# Altium project PCB_Project_2.PrjPcb
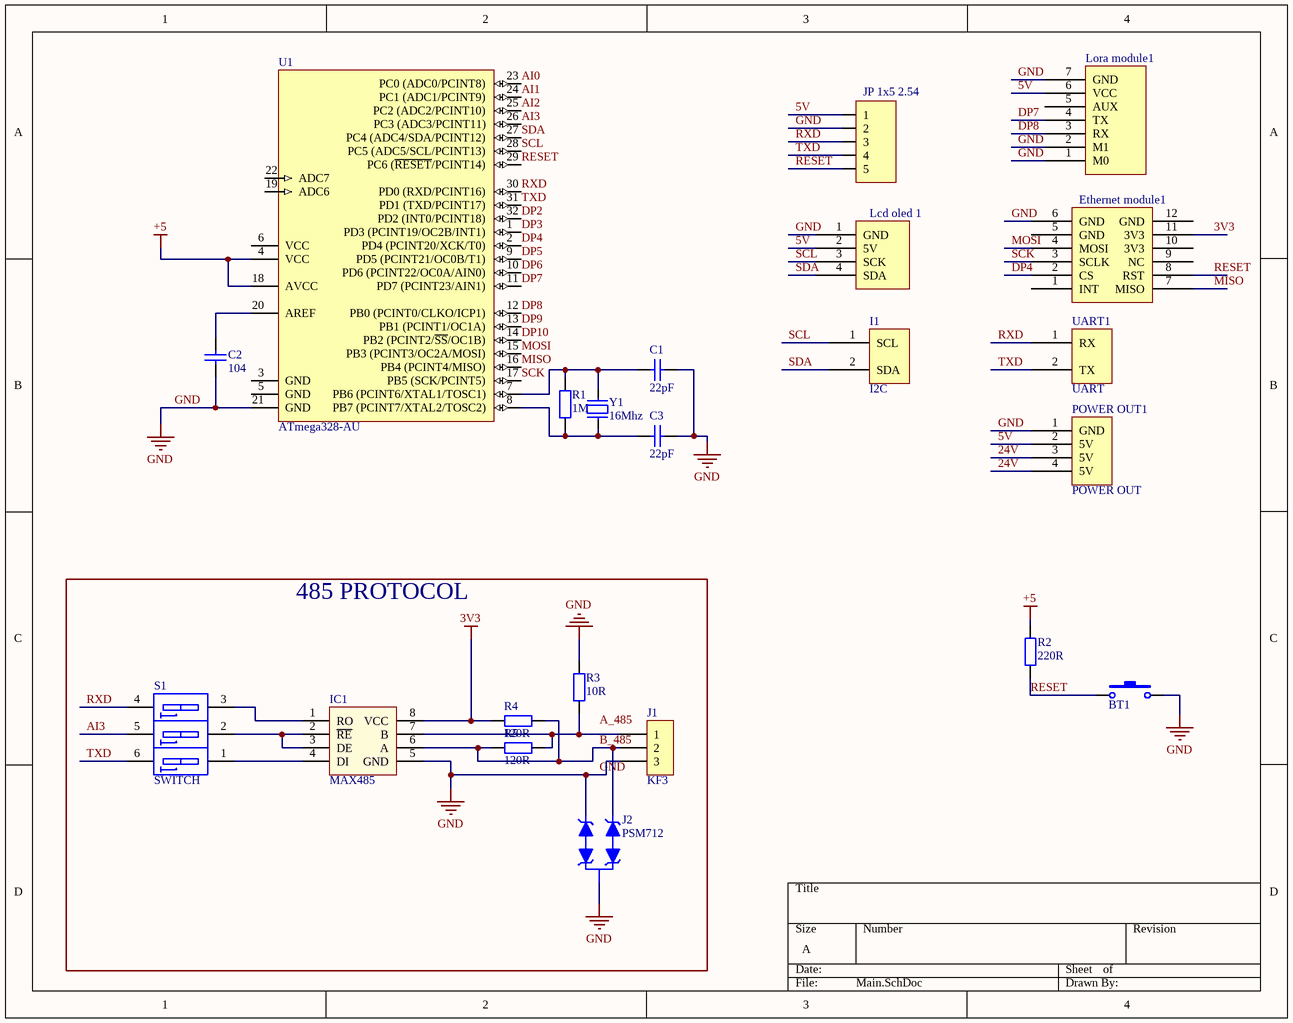
[diagram p0: Main.SchDoc]
4 sheets, 75 parts. Net scope: global (net labels, ports and power ports of the same name join across sheets).
Board file: PCB1.PcbDoc
Sheets:
  Main.SchDoc
  Power.SchDoc
  Input.SchDoc
  OUTPUT.SchDoc

## Sheet Main.SchDoc
size A

### Parts
BT1  Nut Nhan 2 Chan SMD 3x6x2.5  [Nut Nhan 2 Chan SMD 3x6x2.5]  (value not drawn)
C1  22pF  [tu 0603]
C2  104  [tu 0603]
C3  22pF  [tu 0603]
Ethernet_module1  Ethernet module  [Ethernet module - duplicate]  (value not drawn)
I1  I2C  [KF2-5.08]
IC1  MAX485  [SO8]
J1  KF3  [KF3-5.08]
J2  PSM712  [SOT23-3]
JP1  JP 1x5 2.54  [JP 1x5 CT]
Lcd_oled_1  Lcd oled 1306 module  [LCD 1306 - duplicate]  (value not drawn)
Lora_module1  Lora module  [LORA E32]  (value not drawn)
POWER_OUT1  POWER OUT  [KF4-5.08]
R1  1M  [tro smd 0805]
R2  220R  [tro smd 0603]
R3  10R  [tro smd 0805]
R4  120R  [tro smd 0805]
R5  120R  [tro smd 0805]
S1  SWITCH  [SW-DIP3]
U1  ATmega328-AU  [TQFP32]
UART1  UART  [KF2-5.08]
Y1  16Mhz  [Thach Anh 2 chan SMD]

### Blocks framed on the sheet
485 PROTOCOL: IC1 J1 J2 R3-R5 S1

### Nets
3V3: Ethernet_module1.11(3V3) IC1.8(VCC) R4.1
5V: JP1.1 Lcd_oled_1.2(5V) Lora_module1.6(VCC) POWER_OUT1.2(5V) R2.2 U1.4(VCC) U1.18(AVCC)  [also labelled +5]
24V: POWER_OUT1.3(5V) POWER_OUT1.4(5V)
GND: BT1.2 C1.2 C2.2 C3.2 Ethernet_module1.6(GND) IC1.5(GND) J1.3 J2.2(A1) J2.3(C) JP1.2 Lcd_oled_1.1(GND) Lora_module1.1(M0) Lora_module1.2(M1) Lora_module1.7(GND) POWER_OUT1.1(GND) R3.1 U1.21(GND)
AI0: U1.23(PC0_(ADC0/PCINT8))
AI1: U1.24(PC1_(ADC1/PCINT9))
AI2: U1.25(PC2_(ADC2/PCINT10))
AI3: S1.5 U1.26(PC3_(ADC3/PCINT11))
B_485: IC1.6(A) J1.2 J2.1(A) R4.2 R5.1
DP2: U1.32(PD2_(INT0/PCINT18))
DP3: U1.1(PD3_(PCINT19/OC2B/INT1))
DP4: Ethernet_module1.2(CS) U1.2(PD4_(PCINT20/XCK/T0))
DP5: U1.9(PD5_(PCINT21/OC0B/T1))
DP6: U1.10(PD6_(PCINT22/OC0A/AIN0))
DP7: Lora_module1.4(TX) U1.11(PD7_(PCINT23/AIN1))
DP8: Lora_module1.3(RX) U1.12(PB0_(PCINT0/CLKO/ICP1))
DP9: U1.13(PB1_(PCINT1/OC1A))
DP10: U1.14(PB2_(PCINT2/~{SS}/OC1B))
MISO: Ethernet_module1.7(MISO) U1.16(PB4_(PCINT4/MISO))
MOSI: Ethernet_module1.4(MOSI) U1.15(PB3_(PCINT3/OC2A/MOSI))
RESET: BT1.1 Ethernet_module1.8(RST) JP1.5 R2.1 U1.29(PC6_(~{RESET}/PCINT14))
RXD: JP1.3 S1.4 U1.30(PD0_(RXD/PCINT16)) UART1.1(RX)
SCK: Ethernet_module1.3(SCLK) U1.17(PB5_(SCK/PCINT5))
SCL: I1.1(SCL) Lcd_oled_1.3(SCK) U1.28(PC5_(ADC5/SCL/PCINT13))
SDA: I1.2(SDA) Lcd_oled_1.4(SDA) U1.27(PC4_(ADC4/SDA/PCINT12))
TXD: JP1.4 S1.6 U1.31(PD1_(TXD/PCINT17)) UART1.2(TX)
NetC1_1: C1.1 R1.1 U1.7(PB6_(PCINT6/XTAL1/TOSC1)) Y1.1
NetC2_1: C2.1 U1.20(AREF)
NetC3_1: C3.1 R1.2 U1.8(PB7_(PCINT7/XTAL2/TOSC2)) Y1.2
NetIC1_1: IC1.1(RO) S1.3
NetIC1_2: IC1.2(~{RE}) IC1.3(DE) S1.2
NetIC1_4: IC1.4(DI) S1.1
NetIC1_7: IC1.7(B) J1.1 R3.2 R5.2

Not connected (* = marked no-connect by the designer): Ethernet_module1 1(INT) 5(GND) 9(NC) 10(3V3) 12(GND); Lora_module1 5(AUX); U1 3(GND) 5(GND) 6(VCC) 19(ADC6) 22(ADC7)

### Notes on the sheet
- Labels drawn without touching a wire or pin: A_485

### Library data of the parts
BT1 = Nut Nhan 2 Chan SMD 3x6x2.5: Ma_Hang: MH001036; Ten: Nút Nhấn 2 Chân 3x6x2.5MM SMD
C1 C3 = Tu 0603 22pF 50V 10%: Dán; Don_Vi: Con; So_Chan: 2; Ten_Linh_Kien: Tụ 0603 22pF 50V 10%; Ma_Hang: MH004570; Chung_Loai: Dán; Kieu_Chan: *
C2 = Tu 0603 104 50V 10%: Dán; Don_Vi: Con; So_Chan: 2; Ten_Linh_Kien: Tụ 0603 104-100nF 10% 50V; Ma_Hang: MH004568; Chung_Loai: Dán; Kieu_Chan: *
IC1 = MAX485: RS232 - RS485 (Same sn75176)
J1 = KF3: Manufacturer: Würth Elektronik eiSos GmbH; partNo: 691103110003; ComponentLink1 Description: Manufacturer; ComponentLink2 Description: Datasheet; NoPins: 3; Created Date: 29 October 2013; ComponentLink1URL: http://www.we-online.com; ComponentLink2URL: http://katalog.we-online.de/em/datasheet/6911031100xx.pdf; Created by: Karrer Zheng
J2 = PSM712: 19V Clamp 1A (8/20Âµs) Ipp Tvs Diode Surface Mount SOT-23; MF: Protek Devices; SnapEDA_Link: https://www.snapeda.com/parts/PSM712/Protek+Devices/view-part/?ref=snap; Value: *; Check_prices: https://www.snapeda.com/parts/PSM712/Protek+Devices/view-part/?ref=eda; Availability: In Stock; Price: None; MP: PSM712; Package: Package
JP1 = JP 1x5 2.54 Cai Thang: Cắm; Ten_Linh_Kien: Jump Đơn Cái 2.54MM 1x20P Thẳng; Don_Vi: Con; Ma_Hang: MH004006; Ghi_Chu: *; Kieu_Chan: *; Chung_Loai: Cắm
R1 = Tro 0805 5% 1M: Dán; Don_Vi: Con; So_Chan: 2; Ten_Linh_Kien: Trở 0805 5% 1M; Ma_Hang: MH005235; Chung_Loai: Dán; Kieu_Chan: *
R2 = Tro 0603 5% 220R: Dán; Don_Vi: Con; So_Chan: 2; Ten_Linh_Kien: Trở 0603 5% 220R; Ma_Hang: MH006322; Chung_Loai: Dán; Kieu_Chan: *
R3-R5 = Tro 0805 1% 10R: Dán; Don_Vi: Con; So_Chan: 2; Ten_Linh_Kien: Trở 0805 1% 10R; Ma_Hang: MH005474; Chung_Loai: Dán; Kieu_Chan: *
S1 = SWDIP3: WS-DITV 2.54 mm small compact THT flat actuator with top tape; Manufacturer: Wurth Elektronik; Part No.: 418127160901; ComponentLink1 Description: Manufacturer; ComponentLink2 Description: Datasheet; Pole: 01; Created Date: Dec.2015; ComponentLink1URL: http://www.we-online.com; ComponentLink2URL: http://katalog.we-online.de/em/datasheet/4181271609xx.pdf; Created by: Baojun Chen
U1 = ATmega328-AU: 8-bit AVR Microcontroller, 32KB Flash, 1KB EEPROM, 2KB SRAM, 32-pin TQFP, Industrial Grade (-40°C to 85°C); Published: 1-Apr-2010; DatasheetVersion: revA, Jan-2010; PackageVersion: revB, Oct-2001; PackageReference: 32A; Publisher: Altium Limited; PackageDescription: 32-Lead, 7x7x1.0 mm Body, 0.8mm Lead Pitch, Thin Profile Plastic Quad Flat Package (TQFP); Supplier 1: Digi-Key; Supplier Part Number 1: ATMEGA328-AU-ND; Supplier 2: Mouser; Supplier Part Number 2: 556-ATMEGA328-AU; Code_JEDEC: MS-026-ABA; ComponentLink1Description: Manufacturer Link; ComponentLink1URL: http://www.atmel.com/products/avr/default.asp?; ComponentLink2Description: ATmega48A/48PA/88A/88PA/168A/168PA/328/328P Datasheet; ComponentLink2URL: http://www.atmel.com/dyn/resources/prod_documents/8271.pdf; ComponentLink3Description: ATmega48A/48PA/88A/88PA/168A/168PA/328/328P Summary; ComponentLink3URL: http://www.atmel.com/dyn/resources/prod_documents/8271S.pdf; ComponentLink4Description: Atmel.com Home; ComponentLink4URL: http://www.atmel.com
Y1 = Thach Anh 2 chan SMD: Crystal For all Crystal 2pin.; Value: 4Mhz

## Sheet Power.SchDoc
size A
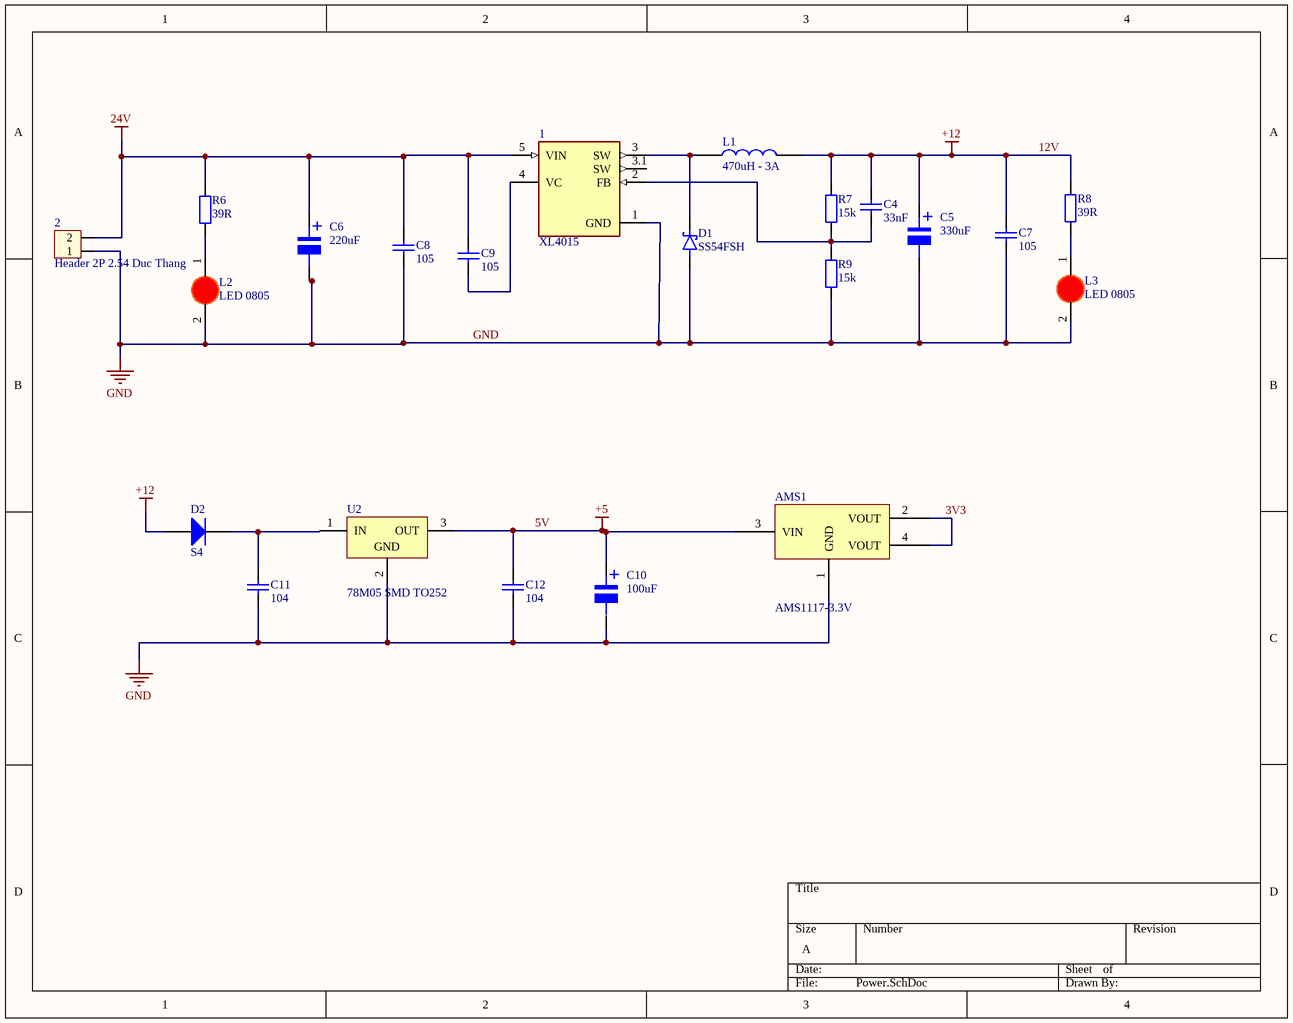
[diagram p1: Power.SchDoc]

### Parts
1  XL4015  [CONV_XL4015]
2  Header 2P 2.54 Duc Thang  [KF2-5.08]
AMS1  AMS1117-3.3V  [SOT223]
C4  33nF  [tu 0402]
C5  330uF  [tu nhom 10 (g)]
C6  220uF  [tu nhom 10 (g)]
C7  105  [tu 0603]
C8  105  [tu 0603]
C9  105  [tu 0603]
C10  100uF  [tu nhom 6.3 (d)]
C11  104  [tu 1206]
C12  104  [tu 1206]
D1  SS54FSH  [SODFL4725X110N]
D2  S4  [DIODE SOD-123]
L1  470uH - 3A  [CUON CAM 100uH3A]
L2  LED 0805  [LED-0805-Red]
L3  LED 0805  [LED-0805-Red]
R6  39R  [tro smd 0603]
R7  15k  [tro smd 0603]
R8  39R  [tro smd 0603]
R9  15k  [tro smd 0603]
U2  78M05 SMD TO252  [TO252]

### Nets
3V3: AMS1.2(VOUT) AMS1.4(VOUT)
5V: AMS1.3(VIN) C10.1 C12.1 U2.3(OUT)  [also labelled +5]
12V: C4.1 C5.1 C7.1 D2.1(A) L1.2 R7.2 R8.2  [also labelled +12]
24V: 1.5(VIN) 2.2 C6.1 C8.2 C9.2 R6.2
GND: 1.1(GND) 2.1 AMS1.1(GND) C5.2 C6.2 C7.2 C8.1 C10.2 C11.2 C12.2 D1.A L2.2(K) L3.2(K) R9.1 U2.2(GND)
Net1_2: 1.2(FB) C4.2 R7.1 R9.2
Net1_3: 1.3(SW) D1.C(K) L1.1
Net1_4: 1.4(VC) C9.1
NetC11_1: C11.1 D2.2(K) U2.1(IN)
NetL2_1: L2.1(A) R6.1
NetL3_1: L3.1(A) R8.1

Not connected (* = marked no-connect by the designer): 1 3.1(SW)

### Notes on the sheet
- (in symbol Tu Nhom 100uF 25V) +
- (in symbol Tu Nhom 220uF 50V) +
- (in symbol Tu Nhom 330uF 50V) +

### Library data of the parts
1 = XL4015: 5A 180KHz 36V Buck DC to DC Converter; Price: None; MP: XL4015; Value: *; Availability: Unavailable; Package: None
2 = Header 2P 2.54 Duc Thang: Cắm; Ten_Linh_Kien: Header 2P XH2.54-2P Đực Thẳng; Don_Vi: Con; Ma_Hang: MH001283; Chung_Loai: Cắm
AMS1 = AMS1117 SMD: Dán; Value: AMS1117-3.3V SOT223; Don_Vi: Con; Ma_Hang: MH000596; Ghi_Chu: *; Kieu_Chan: *; Chung_Loai: Dán
C4 = Tu 0402 33nF 10V: Dán; Don_Vi: Con; So_Chan: 2; Ten_Linh_Kien: Tụ 0402 33nF X7R 10V GRM155R71A333KA01D; Ma_Hang: MH007853; Chung_Loai: Dán; Kieu_Chan: *
C5 = Tu Nhom 330uF 50V: Dán; Don_Vi: Con; So_Chan: 2; Ten_Linh_Kien: Tụ Nhôm 330uF 50V 10x10.2MM; Ma_Hang: MH002225; Chung_Loai: Dán; Kieu_Chan: *
C6 = Tu Nhom 220uF 50V: Dán; Don_Vi: Con; So_Chan: 2; Ten_Linh_Kien: Tụ Nhôm 220uF 50V 10x10.2MM; Ma_Hang: MH002228; Chung_Loai: Dán; Kieu_Chan: *
C7 = Tu 0603 105 16V 20%: Dán; Don_Vi: Con; So_Chan: 2; Ten_Linh_Kien: Tụ 0603 105-1uF 20% 16V; Ma_Hang: MH004574; Chung_Loai: Dán; Kieu_Chan: *
C8 C9 = Tu 0603 105 50V 10%: Dán; Don_Vi: Con; So_Chan: 2; Ten_Linh_Kien: Tụ 0603 105-1uF 50V 10%; Ma_Hang: MH004569; Chung_Loai: Dán; Kieu_Chan: *
C10 = Tu Nhom 100uF 25V: Dán; Don_Vi: Con; So_Chan: 2; Ten_Linh_Kien: Tụ Nhôm 100uF 25V 6x7MM; Ma_Hang: MH002222; Chung_Loai: Dán; Kieu_Chan: *
C11 C12 = Tu 1206 104 50V 20%: Dán; Don_Vi: Con; So_Chan: 2; Ten_Linh_Kien: Tụ 1206 104-0.1uF 20% 50V; Ma_Hang: MH004544; Chung_Loai: Dán; Kieu_Chan: *
D1 = SS54FSH: 5A, 40V, Schottky Rectifier; MF: Taiwan Semiconductor; Value: *; SnapEDA_Link: https://www.snapeda.com/parts/SS54FSH/Taiwan+Semiconductor/view-part/?ref=snap; MP: SS54FSH; Check_prices: https://www.snapeda.com/parts/SS54FSH/Taiwan+Semiconductor/view-part/?ref=eda; Availability: In Stock; Price: None; Package: SOD-128-2 Taiwan Semiconductor
D2 = Diode S4: Dán; Ten_Linh_Kien: Diode S4 SOD123 ( 1N5819 SOD123); Ma_Hang: MH005519; Don_Vi: Con; Ghi_Chu: *; Chung_Loai: Dán; Kieu_Chan: *
L1 = CUON CAM 470uH DIP: Cắm; Don_Vi: Con; Ma_Hang: MH002232; Ten_Linh_Kien: Cuộn Cảm 470uH 3A 8x10MM; Ghi_Chu: *; Kieu_Chan: *; Chung_Loai: Cắm
L2 L3 = LED 0805 Do: Dán; Don_Vi: Con; Ma_Hang: MH000897; Ten_Linh_Kien: LED 0805 Màu Đỏ (Red); Ghi_Chu: *; Kieu_Chan: *; Chung_Loai: Dán
R6 R8 = Tro 0603 5% 39R: Dán; Don_Vi: Con; So_Chan: 2; Ten_Linh_Kien: Trở 0603 5% 39R; Ma_Hang: MH008714; Chung_Loai: Dán; Kieu_Chan: *
R7 R9 = Tro 0603 5% 15k: Dán; So_Chan: 2; Don_Vi: Con; Ten_Linh_Kien: Trở 0603 5% 15k; Ma_Hang: MH004575; Chung_Loai: Dán; Kieu_Chan: *
U2 = 78M05 SMD TO252: Dán; Don_Vi: Con; Ten_Linh_Kien: 78M05 TO252; Ma_Hang: MH001917; Ghi_Chu: *; Kieu_Chan: *; Chung_Loai: Dán

## Sheet Input.SchDoc
size A
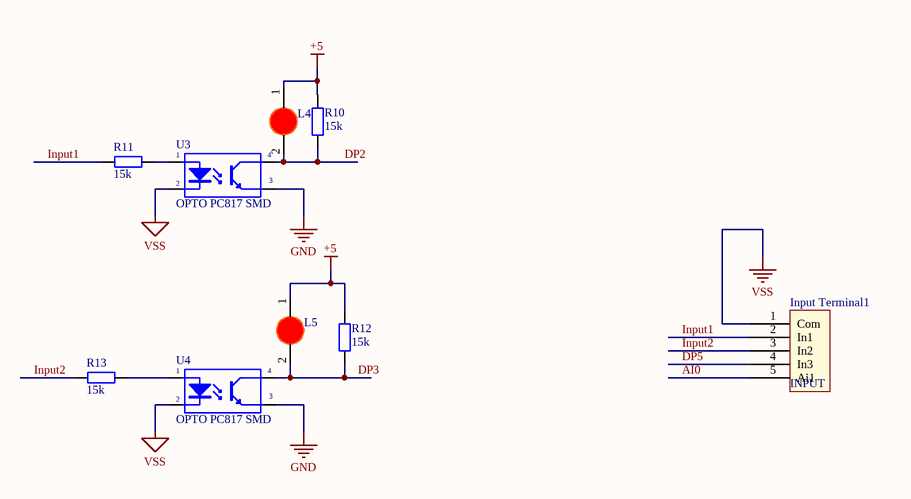
[diagram p2: Input.SchDoc]

### Parts
Input_Terminal1  INPUT  [KF5-5]
L4  LED 0805  [LED-1206-Red]  (value not drawn)
L5  LED 0805  [LED-1206-Red]  (value not drawn)
R10  15k  [tro smd 0805]
R11  15k  [tro smd 0805]
R12  15k  [tro smd 0805]
R13  15k  [tro smd 0805]
U3  OPTO PC817 SMD  [SOP4]
U4  OPTO PC817 SMD  [SOP4]

### Nets
+5: L4.1(A) L5.1(A) R10.2 R12.2  [project net 5V]
GND: U3.3(E) U4.3(E)
VSS: Input_Terminal1.1(Com) U3.2(K) U4.2(K)
AI0: Input_Terminal1.5(Ai1)
DP2: L4.2(K) R10.1 U3.4(C)
DP3: L5.2(K) R12.1 U4.4(C)
DP5: Input_Terminal1.4(In3)
Input1: Input_Terminal1.2(In1) R11.1
Input2: Input_Terminal1.3(In2) R13.1
NetR11_2: R11.2 U3.1(A)
NetR13_2: R13.2 U4.1(A)

### Library data of the parts
L4 L5 = LED 1206 Do: Dán; Don_Vi: Con; Ma_Hang: MH002334; Ten_Linh_Kien: LED1206 Màu Đỏ (Red); Ghi_Chu: *; Kieu_Chan: *; Chung_Loai: Dán
R10-R13 = Tro 0805 1% 15k: Dán; Don_Vi: Con; So_Chan: 2; Ten_Linh_Kien: Trở 0805 1% 15k; Ma_Hang: MH005476; Chung_Loai: Dán; Kieu_Chan: *
U3 U4 = OPTO PC817 SMD: Single Opto; Value: PC817

## Sheet OUTPUT.SchDoc
size A
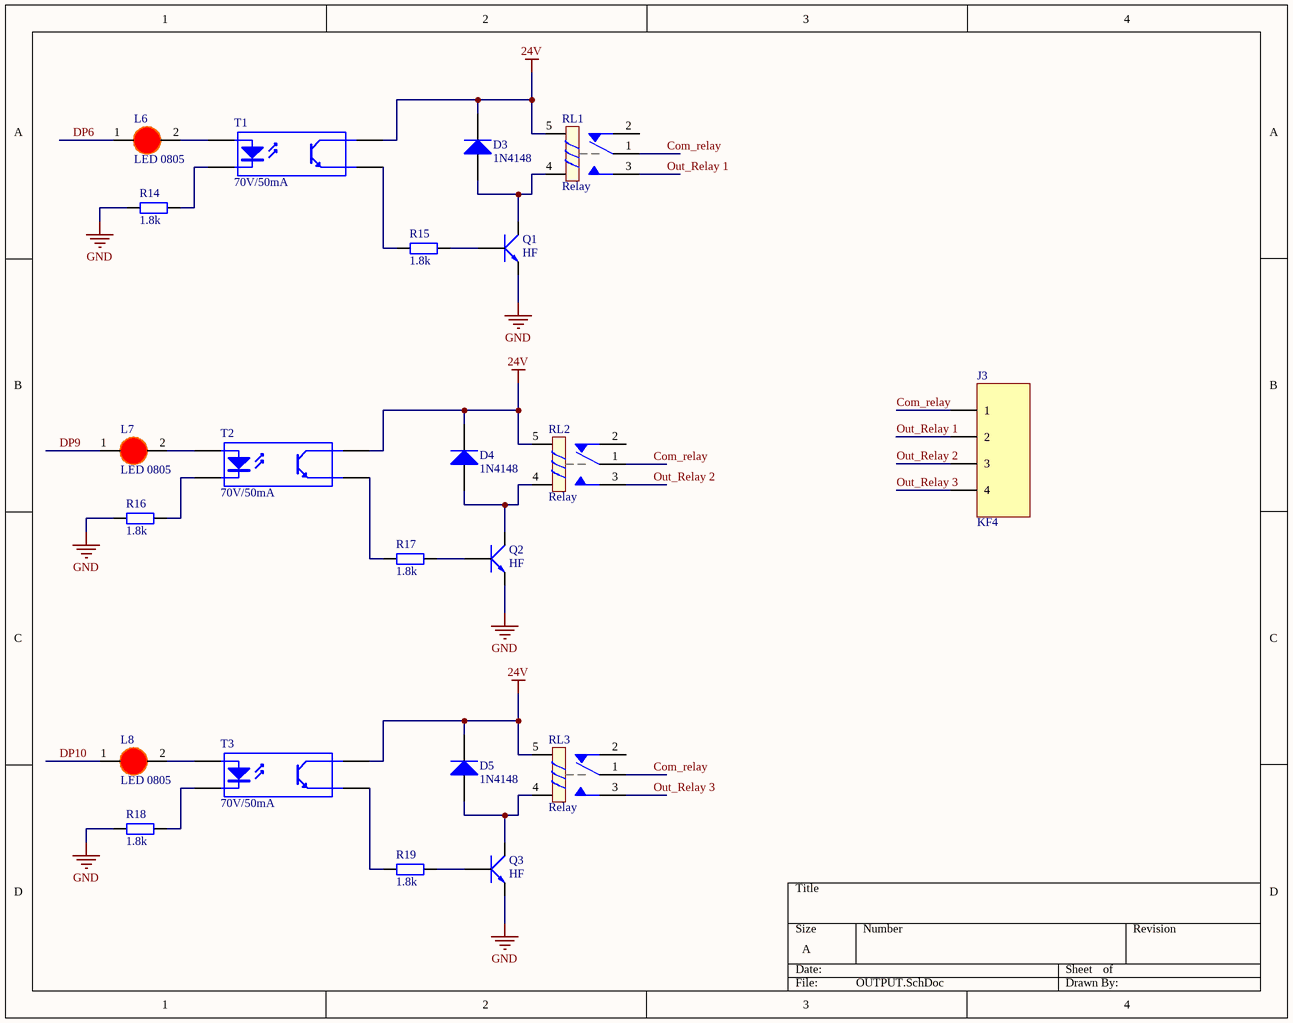
[diagram p3: OUTPUT.SchDoc]

### Parts
D3  1N4148  [SOD-123]
D4  1N4148  [SOD-123]
D5  1N4148  [SOD-123]
J3  KF4  [KF4-5.08]
L6  LED 0805  [LED-1206-Red]
L7  LED 0805  [LED-1206-Red]
L8  LED 0805  [LED-1206-Red]
Q1  HF  [SOT23]
Q2  HF  [SOT23]
Q3  HF  [SOT23]
R14  1.8k  [tro smd 0805]
R15  1.8k  [tro smd 0805]
R16  1.8k  [tro smd 0805]
R17  1.8k  [tro smd 0805]
R18  1.8k  [tro smd 0805]
R19  1.8k  [tro smd 0805]
RL1  Relay  [Relay 5 Chan SRD]
RL2  Relay  [Relay 5 Chan SRD]
RL3  Relay  [Relay 5 Chan SRD]
T1  70V/50mA  [OPTO TRANSISTOR_SMD-4]
T2  70V/50mA  [OPTO TRANSISTOR_SMD-4]
T3  70V/50mA  [OPTO TRANSISTOR_SMD-4]

### Nets
24V: D3.2(K) D4.2(K) D5.2(K) RL1.5 RL2.5 RL3.5 T1.4 T2.4 T3.4
GND: Q1.2(E) Q2.2(E) Q3.2(E) R14.1 R16.1 R18.1
Com_relay: J3.1 RL1.1 RL2.1 RL3.1
DP6: L6.1(A)
DP9: L7.1(A)
DP10: L8.1(A)
Out_Relay 1: J3.2 RL1.3
Out_Relay 2: J3.3 RL2.3
Out_Relay 3: J3.4 RL3.3
NetD3_1: D3.1(A) Q1.3(C) RL1.4
NetD4_1: D4.1(A) Q2.3(C) RL2.4
NetD5_1: D5.1(A) Q3.3(C) RL3.4
NetL6_2: L6.2(K) T1.1
NetL7_2: L7.2(K) T2.1
NetL8_2: L8.2(K) T3.1
NetQ1_1: Q1.1(B) R15.2
NetQ2_1: Q2.1(B) R17.2
NetQ3_1: Q3.1(B) R19.2
NetR14_2: R14.2 T1.2
NetR15_1: R15.1 T1.3
NetR16_2: R16.2 T2.2
NetR17_1: R17.1 T2.3
NetR18_2: R18.2 T3.2
NetR19_1: R19.1 T3.3

Not connected (* = marked no-connect by the designer): RL1 2; RL2 2; RL3 2

### Library data of the parts
D3-D5 = 1N4148-W-7: DIODE GEN PURP 100V 300MA SOD123; MPN: 1N4148W-7-F; MFR: Diodes Incorporated; Solder: SMT; Value: 100V/300MA
J3 = KF4: Manufacturer: W¨¹rth Elektronik eiSos GmbH; PartNo: 691133710004; ComponentLink1 Description: Manufacturer; ComponentLink2 Description: Datasheet; NoPins: 4; ComponentLink1 URL: http://www.we-online.com; ComponentLink2 URL: http://katalog.we-online.de/em/datasheet/6911337100xx.pdf; Created By: Baojun Chen; Created Date: 4-Aug-15
L6-L8 = LED 1206 Do: as L4 on sheet Input; Ghi_Chu: *; Kieu_Chan: *; Chung_Loai: Dán
Q1-Q3 = C1815 HF SMD: NPN transistor; Value: C9014
R14-R19 = Tro 0805 5% 1.8k: Dán; Don_Vi: Con; So_Chan: 2; Ten_Linh_Kien: Trở 0805 5% 1.8k; Ma_Hang: MH005233; Chung_Loai: Dán; Kieu_Chan: *
RL1-RL3 = Relay 5 Chan SRD: Relay 5 Chan; Ma_Hang: MH009374; Ten: Relay 5V10A SRD-05VDC-SL-C Chính Hãng
T1-T3 = HCPL-817-500E: OPTOISOLATOR 5KV TRANSISTOR 4SMD; Solder: SMT; CompanyID: VT-00147; Value: 70V/50mA; MPN: HCPL-817-500E

## Nets that join several sheets
3V3: Main (Ethernet_module1.11 IC1.8 R4.1), Power (AMS1.2 AMS1.4)
5V: Main (7 pins), Power (AMS1.3 C10.1 C12.1 U2.3), Input (L4.1 L5.1 R10.2 R12.2)
24V: Main (POWER_OUT1.3 POWER_OUT1.4), Power (6 pins), OUTPUT (9 pins)
GND: Main (17 pins), Power (15 pins), Input (U3.3 U4.3), OUTPUT (6 pins)
AI0: Main (U1.23), Input (Input_Terminal1.5)
DP2: Main (U1.32), Input (L4.2 R10.1 U3.4)
DP3: Main (U1.1), Input (L5.2 R12.1 U4.4)
DP5: Main (U1.9), Input (Input_Terminal1.4)
DP6: Main (U1.10), OUTPUT (L6.1)
DP9: Main (U1.13), OUTPUT (L7.1)
DP10: Main (U1.14), OUTPUT (L8.1)